# EAGLE design digit_mini (EAGLE 6.3)
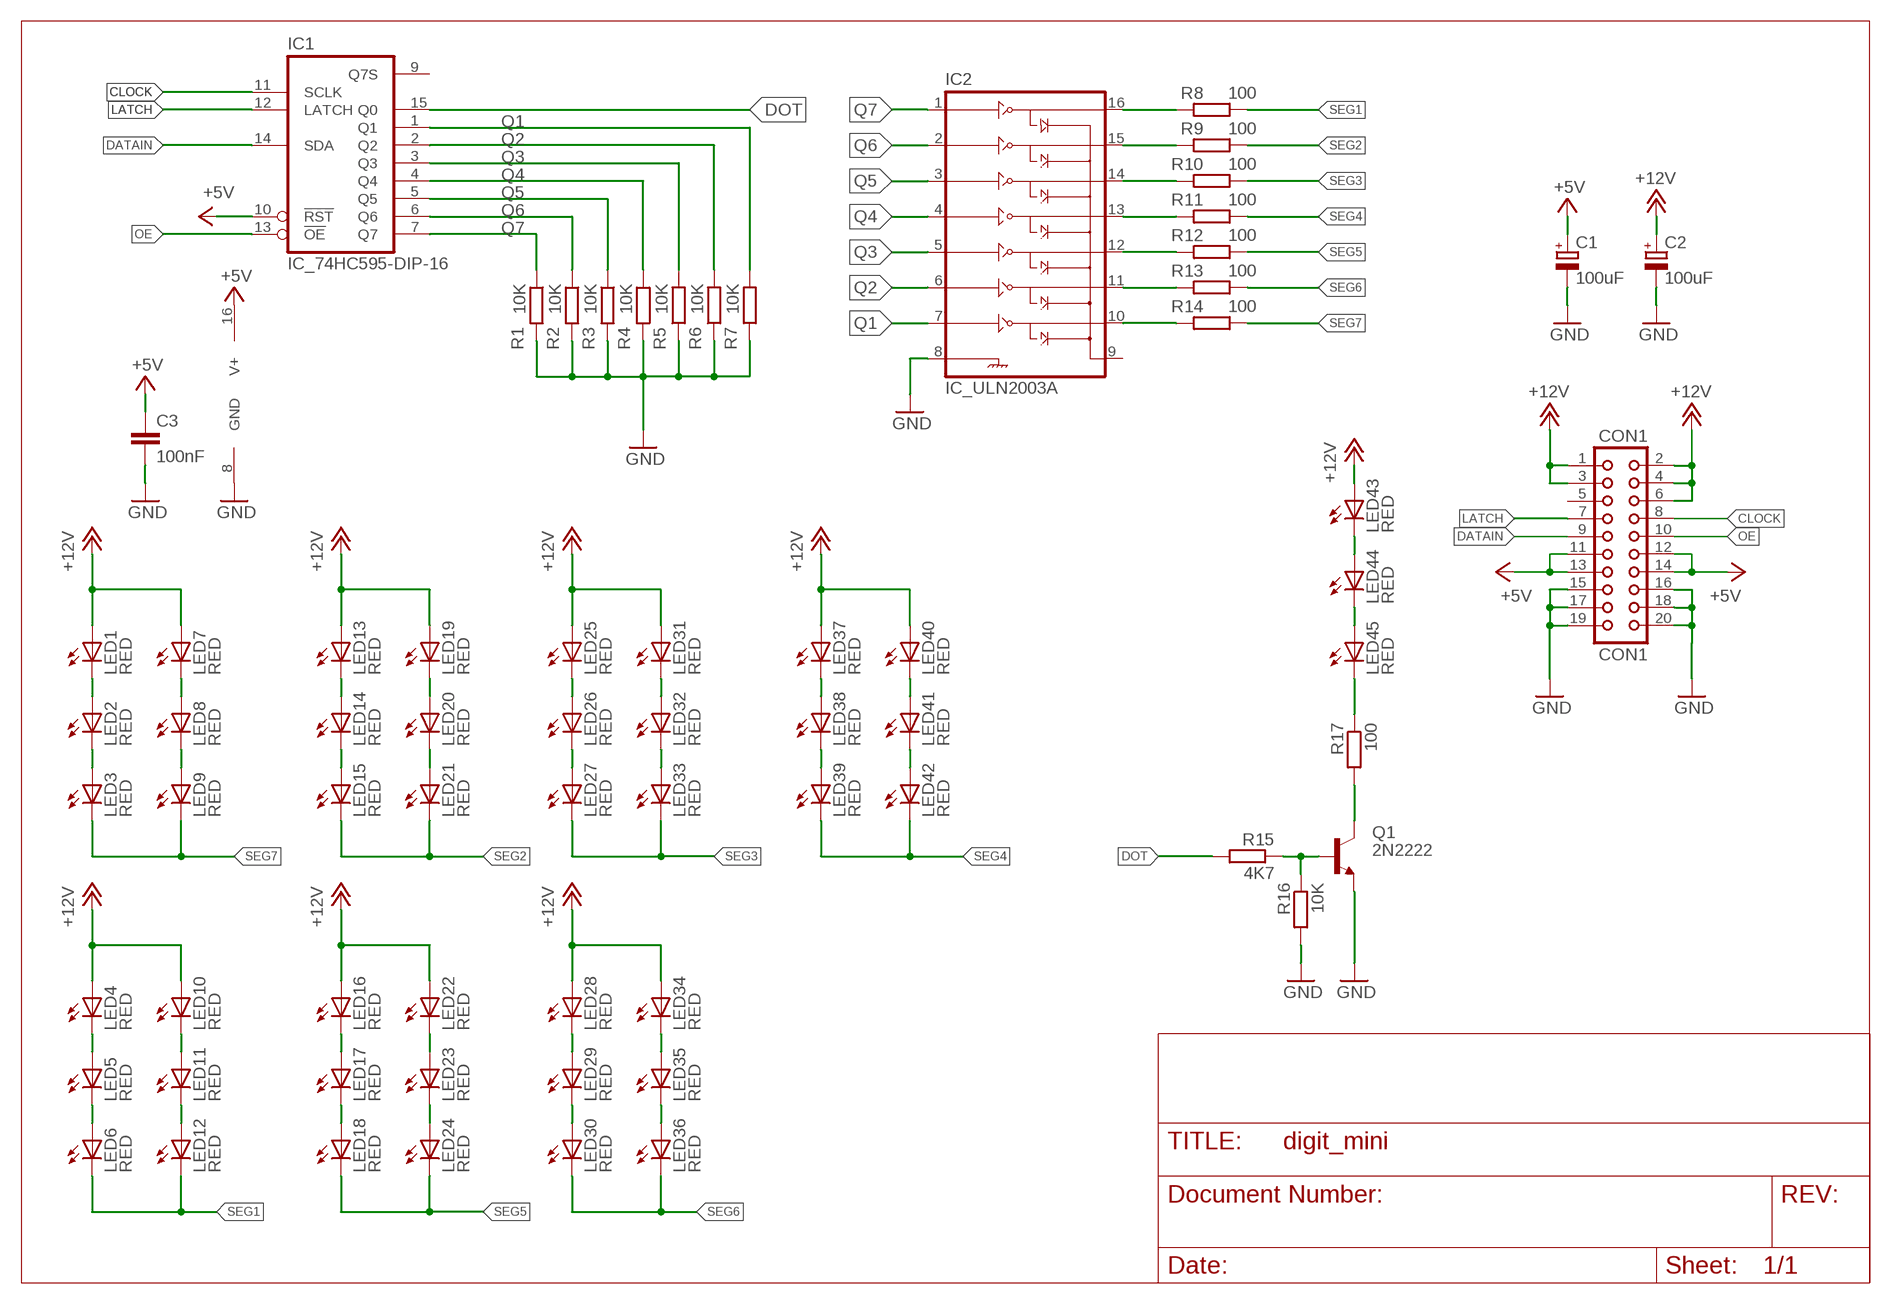
[diagram p0: schematic, sheet 1]

## Parts
C1  100uF  CPOL-EUE2.5-7  [E2,5-7]
C2  100uF  CPOL-EUE2.5-7  [E2,5-7]
C3  100nF  C-EU050-025X075  [C050-025X075]
CON1  CON1  CON20  [CON20]
IC1  IC_74HC595-DIP-16  [DIL16]
IC2  IC_ULN2003A  [DIL16]
LED1  RED  LED5MM  [LED5MM]
LED2  RED  LED5MM  [LED5MM]
LED3  RED  LED5MM  [LED5MM]
LED4  RED  LED5MM  [LED5MM]
LED5  RED  LED5MM  [LED5MM]
LED6  RED  LED5MM  [LED5MM]
LED7  RED  LED5MM  [LED5MM]
LED8  RED  LED5MM  [LED5MM]
LED9  RED  LED5MM  [LED5MM]
LED10  RED  LED5MM  [LED5MM]
LED11  RED  LED5MM  [LED5MM]
LED12  RED  LED5MM  [LED5MM]
LED13  RED  LED5MM  [LED5MM]
LED14  RED  LED5MM  [LED5MM]
LED15  RED  LED5MM  [LED5MM]
LED16  RED  LED5MM  [LED5MM]
LED17  RED  LED5MM  [LED5MM]
LED18  RED  LED5MM  [LED5MM]
LED19  RED  LED5MM  [LED5MM]
LED20  RED  LED5MM  [LED5MM]
LED21  RED  LED5MM  [LED5MM]
LED22  RED  LED5MM  [LED5MM]
LED23  RED  LED5MM  [LED5MM]
LED24  RED  LED5MM  [LED5MM]
LED25  RED  LED5MM  [LED5MM]
LED26  RED  LED5MM  [LED5MM]
LED27  RED  LED5MM  [LED5MM]
LED28  RED  LED5MM  [LED5MM]
LED29  RED  LED5MM  [LED5MM]
LED30  RED  LED5MM  [LED5MM]
LED31  RED  LED5MM  [LED5MM]
LED32  RED  LED5MM  [LED5MM]
LED33  RED  LED5MM  [LED5MM]
LED34  RED  LED5MM  [LED5MM]
LED35  RED  LED5MM  [LED5MM]
LED36  RED  LED5MM  [LED5MM]
LED37  RED  LED5MM  [LED5MM]
LED38  RED  LED5MM  [LED5MM]
LED39  RED  LED5MM  [LED5MM]
LED40  RED  LED5MM  [LED5MM]
LED41  RED  LED5MM  [LED5MM]
LED42  RED  LED5MM  [LED5MM]
LED43  RED  LED5MM  [LED5MM]
LED44  RED  LED5MM  [LED5MM]
LED45  RED  LED5MM  [LED5MM]
Q1  2N2222  -NPN-TO92-E1  [TO92-E1]
R1  10K  R-EU_0207/12  [0207/12]
R2  10K  R-EU_0207/12  [0207/12]
R3  10K  R-EU_0207/12  [0207/12]
R4  10K  R-EU_0207/12  [0207/12]
R5  10K  R-EU_0207/12  [0207/12]
R6  10K  R-EU_0207/12  [0207/12]
R7  10K  R-EU_0207/12  [0207/12]
R8  100  R-EU_0207/12  [0207/12]
R9  100  R-EU_0207/12  [0207/12]
R10  100  R-EU_0207/12  [0207/12]
R11  100  R-EU_0207/12  [0207/12]
R12  100  R-EU_0207/12  [0207/12]
R13  100  R-EU_0207/12  [0207/12]
R14  100  R-EU_0207/12  [0207/12]
R15  4K7  R-EU_0207/12  [0207/12]
R16  10K  R-EU_0207/12  [0207/12]
R17  100  R-EU_0207/12  [0207/12]

## Nets
+5V: C1.+ C3.1 CON1.11 CON1.12 CON1.13 CON1.14 IC1.10(!RST) IC1.16(V+)
+12V: C2.+ CON1.1 CON1.2 CON1.3 CON1.4 CON1.6 LED1.A LED4.A LED7.A LED10.A LED13.A LED16.A LED19.A LED22.A LED25.A LED28.A LED31.A LED34.A LED37.A LED40.A LED43.A
CLOCK: CON1.8 IC1.11(SCLK)
DATAIN: CON1.9 IC1.14(SDA)
DOT: IC1.15(Q0) R15.2
GND: C1.- C2.- C3.2 CON1.15 CON1.16 CON1.17 CON1.18 CON1.19 CON1.20 IC1.8(GND) IC2.8(GND) Q1.3(E) R1.2 R2.2 R3.2 R4.1 R5.1 R6.1 R7.1 R16.2
LATCH: CON1.7 IC1.12(LATCH)
N$1: LED45.K(C) R17.1
N$2: Q1.1(C) R17.2
N$8: IC2.15(2C) R9.2
N$9: LED13.K(C) LED14.A
N$10: LED14.K(C) LED15.A
N$11: IC2.14(3C) R10.2
N$12: IC2.13(4C) R11.2
N$13: LED19.K(C) LED20.A
N$14: LED20.K(C) LED21.A
N$16: IC2.12(5C) R12.2
N$17: IC2.11(6C) R13.2
N$19: IC2.10(7C) R14.2
N$20: LED25.K(C) LED26.A
N$21: IC2.16(1C) R8.2
N$22: LED26.K(C) LED27.A
N$23: LED1.K(C) LED2.A
N$24: LED2.K(C) LED3.A
N$25: LED7.K(C) LED8.A
N$26: LED8.K(C) LED9.A
N$28: LED31.K(C) LED32.A
N$29: LED32.K(C) LED33.A
N$31: LED37.K(C) LED38.A
N$32: LED38.K(C) LED39.A
N$33: LED40.K(C) LED41.A
N$34: LED41.K(C) LED42.A
N$36: LED16.K(C) LED17.A
N$37: LED17.K(C) LED18.A
N$38: LED22.K(C) LED23.A
N$39: LED23.K(C) LED24.A
N$41: LED28.K(C) LED29.A
N$42: LED29.K(C) LED30.A
N$43: LED34.K(C) LED35.A
N$44: LED35.K(C) LED36.A
N$46: LED4.K(C) LED5.A
N$47: LED5.K(C) LED6.A
N$48: LED10.K(C) LED11.A
N$49: LED11.K(C) LED12.A
N$50: LED43.K(C) LED44.A
N$51: Q1.2(B) R15.1 R16.1
N$52: LED44.K(C) LED45.A
OE: CON1.10 IC1.13(!OE)
Q1: IC1.1(Q1) IC2.7(7B) R7.2
Q2: IC1.2(Q2) IC2.6(6B) R6.2
Q3: IC1.3(Q3) IC2.5(5B) R5.2
Q4: IC1.4(Q4) IC2.4(4B) R4.2
Q5: IC1.5(Q5) IC2.3(3B) R3.1
Q6: IC1.6(Q6) IC2.2(2B) R2.1
Q7: IC1.7(Q7) IC2.1(1B) R1.1
SEG1: LED6.K(C) LED12.K(C) R8.1
SEG2: LED15.K(C) LED21.K(C) R9.1
SEG3: LED27.K(C) LED33.K(C) R10.1
SEG4: LED39.K(C) LED42.K(C) R11.1
SEG5: LED18.K(C) LED24.K(C) R12.1
SEG6: LED30.K(C) LED36.K(C) R13.1
SEG7: LED3.K(C) LED9.K(C) R14.1
Unconnected: CON1.5 IC1.9(Q7S) IC2.9(COM)

## Library data of the parts
C1 C2 = resistor:CPOL-EU: POLARIZED CAPACITOR, European symbol
C3 = rcl:C-EU: CAPACITOR, European symbol
CON1 = con-harting:CON20: CONNECTOR; OC_FARNELL: unknown; OC_NEWARK: unknown
IC1 = dp_devices:IC_74HC595: 8-bit serial-in parallel out shift register, output latch 3-state
IC2 = dp_devices:IC_ULN2003A: ULN2003A Seven Darlington array
LED1-LED45 = led:LED: LED OSRAM: - CHIPLED LG R971, LG N971, LY N971, LG Q971, LY Q971, LO R971, LY R971 LH N974, LH R974 LS Q976, LO Q976, LY Q976 LO Q996 - Hyper CHIPLED LW Q18S LB Q993, LB Q99A, LB R99A - SideLED LS A670, LO A670, LY A670, LG A670, LP A670 LB A673, LV A673, LT A673, LW A673 LH A674 LY A675 LS A676, LA A676, LO A676, LY A676, LW A676 LS A679, LY A679, LG A679 - Hyper Micro SIDELED® LS Y876, LA Y876, LO Y876, LY Y876 LT Y87S - SmartLED LW L88C, LW L88S LB L89C, LB L89S, LG L890 LS L89K, LO L89K, LY L89K LS L896, LA L896, LO L896, LY L896 - TOPLED LS T670, LO T670, LY T670, LG T670, LP T670 LSG T670, LSP T670, LSY T670, LOP T670, LYG T670 LG T671, LOG T671, LSG T671 LB T673, LV T673, LT T673, LW T673 LH T674 LS T676, LA T676, LO T676, LY T676, LB T676, LH T676, LSB T676, LW T676 LB T67C, LV T67C, LT T67C, LS T67K, LO T67K, LY T67K, LW E67C LS E67B, LA E67B, LO E67B, LY E67B, LB E67C, LV E67C, LT E67C LW T67C LS T679, LY T679, LG T679 LS T770, LO T770, LY T770, LG T770, LP T770 LB T773, LV T773, LT T773, LW T773 LH T774 LS E675, LA E675, LY E675, LS T675 LS T776, LA T776, LO T776, LY T776, LB T776 LHGB T686 LT T68C, LB T68C - Hyper Mini TOPLED® LB M676 - Mini TOPLED Santana® LG M470 LS M47K, LO M47K, LY M47K Source: http://www.osram.convergy.de LUXEON: - LUMILED® LXK2-PW12-R00, LXK2-PW12-S00, LXK2-PW14-U00, LXK2-PW14-V00 LXK2-PM12-R00, LXK2-PM12-S00, LXK2-PM14-U00 LXK2-PE12-Q00, LXK2-PE12-R00, LXK2-PE12-S00, LXK2-PE14-T00, LXK2-PE14-U00 LXK2-PB12-K00, LXK2-PB12-L00, LXK2-PB12-M00, LXK2-PB14-N00, LXK2-PB14-P00, LXK2-PB14-Q00 LXK2-PR12-L00, LXK2-PR12-M00, LXK2-PR14-Q00, LXK2-PR14-R00 LXK2-PD12-Q00, LXK2-PD12-R00, LXK2-PD12-S00 LXK2-PH12-R00, LXK2-PH12-S00 LXK2-PL12-P00, LXK2-PL12-Q00, LXK2-PL12-R00 Source: www.luxeon.com KINGBRIGHT: KA-3528ASYC Source: www.kingbright.com
Q1 = transistor:*-NPN-: NPN Transistror BF959 corrected 2008.03.06
R1-R17 = resistor:R-EU_: RESISTOR, European symbol

## Net classes
0 default: width 0.305 mm

## Board
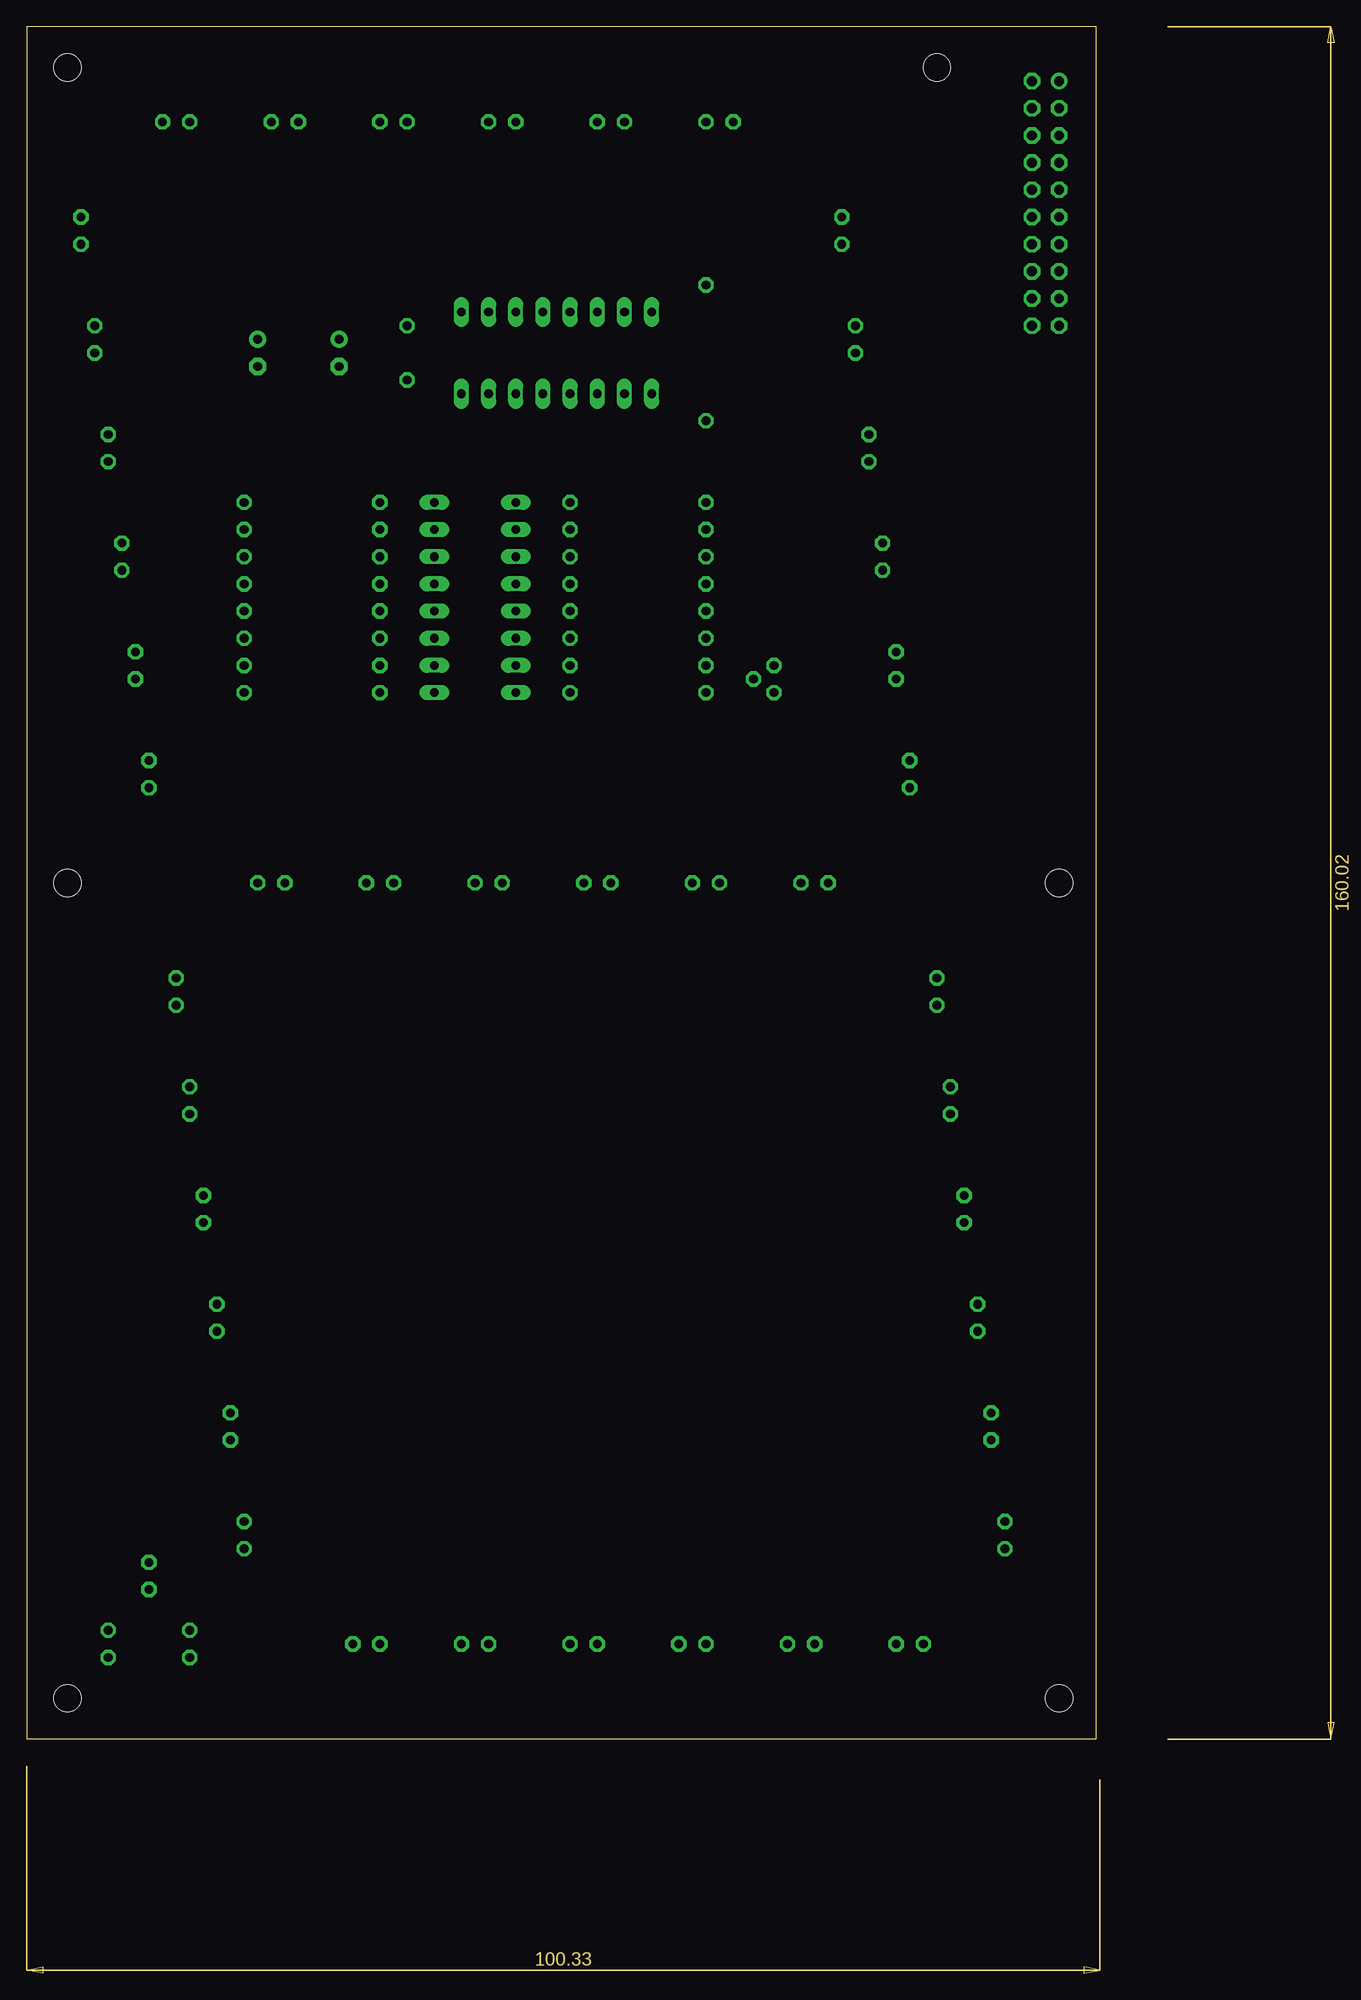
[diagram p1: board, top side]
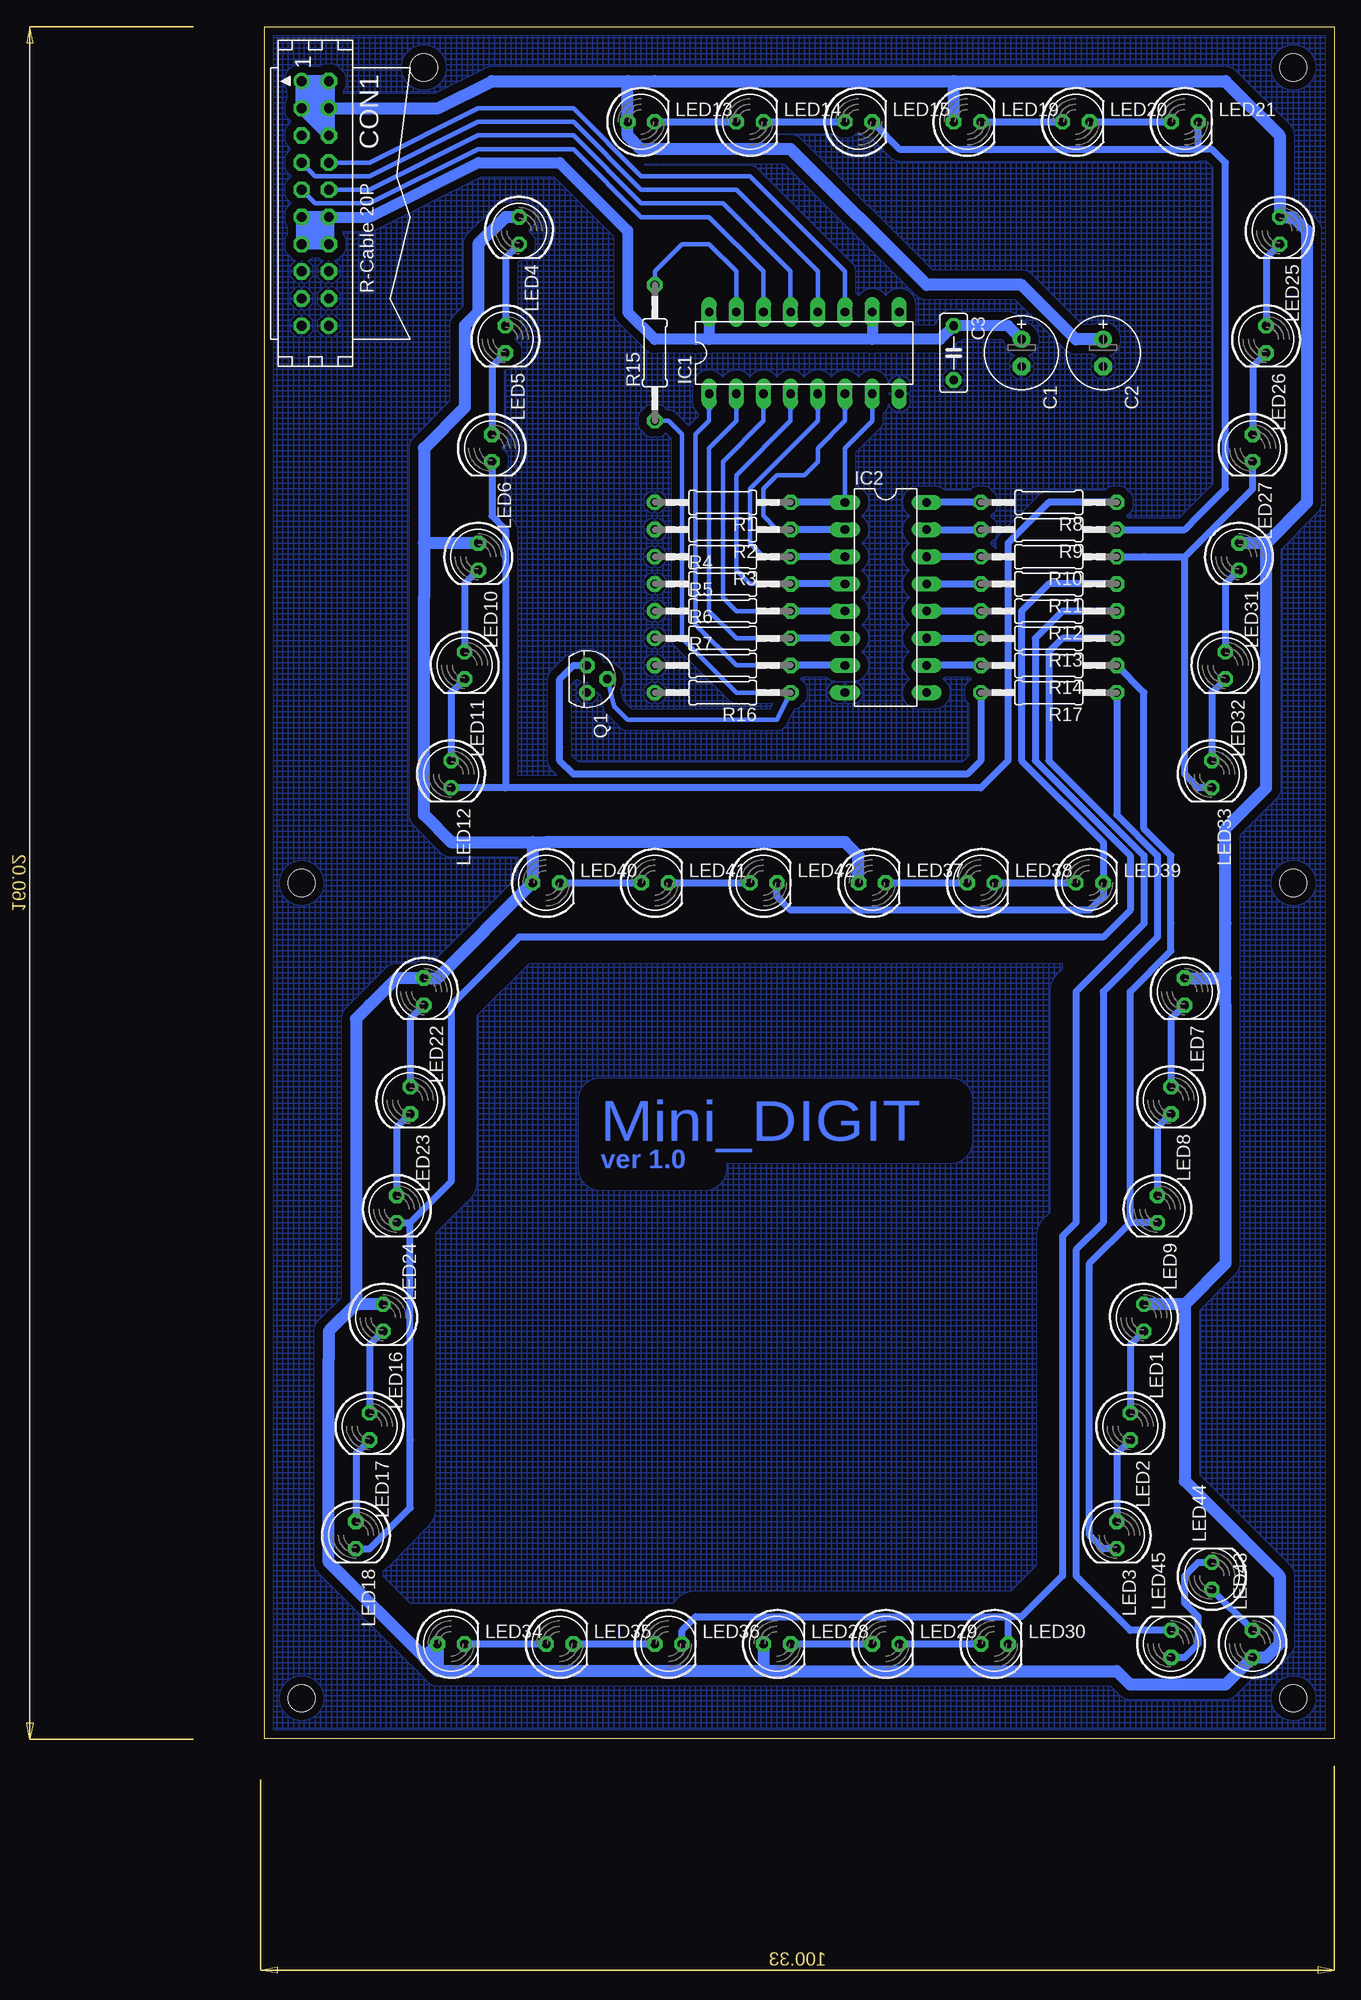
[diagram p2: board, bottom side, seen from below]

Size 100 x 160 mm. Coordinates in mm from the lower left corner, seen from the top.
Outline: 100,160 100,0 0,0 0,160
Outline: 100,160 0,160
Outline: 100,160 0,160
Copper layers (1*16): Top 0.035mm / dielectric 1.5mm / Bottom 0.035mm
Design rules "SparkFun": minimum track width 8mil, minimum drill 20mil, track to track 8mil, track to pad 8mil, pad to pad 8mil, via to via 8mil, smd to smd 8mil, copper to edge 10mil, drill to drill 8mil, minimum pad ring 12mil, minimum via ring 10mil, stop-mask expansion 4mil, vias tented up to drill 25mil, thermal gap 10mil
Holes 2.54 mm at 85.09,156.19 96.52,79.99 3.81,79.99 3.81,3.79 96.52,3.79 3.81,156.19

### Footprints (pad centres in the part's own frame; a part is rotated, then mirrored left to right if it is on the bottom)
E2,5-7 = drill 0.813 pad 1.6: + -1.27,0 | drill 0.813 pad 1.6 octagon: - 1.27,0
C050-025X075 = drill 0.813 octagon: 1 -2.54,0; 2 2.54,0
CON20 = drill 0.914: 1 -11.43,-1.27 | drill 0.914 octagon: 2 -11.43,1.27; 3 -8.89,-1.27; 4 -8.89,1.27; 5 -6.35,-1.27; 6 -6.35,1.27; 7 -3.81,-1.27; 8 -3.81,1.27; 9 -1.27,-1.27; 10 -1.27,1.27; 11 1.27,-1.27; 12 1.27,1.27; 13 3.81,-1.27; 14 3.81,1.27; 15 6.35,-1.27; 16 6.35,1.27; 17 8.89,-1.27; 18 8.89,1.27; 19 11.43,-1.27; 20 11.43,1.27
DIL16 = drill 0.813 long: 1 -8.89,-3.81; 2 -6.35,-3.81; 3 -3.81,-3.81; 4 -1.27,-3.81; 5 1.27,-3.81; 6 3.81,-3.81; 7 6.35,-3.81; 8 8.89,-3.81; 9 8.89,3.81; 10 6.35,3.81; 11 3.81,3.81; 12 1.27,3.81; 13 -1.27,3.81; 14 -3.81,3.81; 15 -6.35,3.81; 16 -8.89,3.81
LED5MM = drill 0.813 octagon: A -1.27,0; K 1.27,0
TO92-E1 = drill 0.813 octagon: 1 -1.27,0; 2 0,1.905; 3 1.27,0
0207/12 = drill 0.813 octagon: 1 -6.35,0; 2 6.35,0

### Placement (x,y rotation side)
C1  29.21,129.52 270 bottom
C2  21.59,129.52 270 bottom
C3  35.56,129.52 270 bottom
CON1  95.25,143.49 270 bottom
IC1  49.53,129.52 0 bottom
IC2  41.91,106.66 270 bottom
LED1  17.78,39.35 270 bottom
LED2  19.05,29.19 270 bottom
LED3  20.32,19.03 270 bottom
LED4  76.2,140.95 270 bottom
LED5  77.47,130.79 270 bottom
LED6  78.74,120.63 270 bottom
LED7  13.97,69.83 270 bottom
LED8  15.24,59.67 270 bottom
LED9  16.51,49.51 270 bottom
LED10  80.01,110.47 270 bottom
LED11  81.28,100.31 270 bottom
LED12  82.55,90.15 270 bottom
LED13  64.77,151.11 0 bottom
LED14  54.61,151.11 0 bottom
LED15  44.45,151.11 0 bottom
LED16  88.9,39.35 270 bottom
LED17  90.17,29.19 270 bottom
LED18  91.44,19.03 270 bottom
LED19  34.29,151.11 0 bottom
LED20  24.13,151.11 0 bottom
LED21  13.97,151.11 0 bottom
LED22  85.09,69.83 270 bottom
LED23  86.36,59.67 270 bottom
LED24  87.63,49.51 270 bottom
LED25  5.08,140.95 270 bottom
LED26  6.35,130.79 270 bottom
LED27  7.62,120.63 270 bottom
LED28  52.07,8.87 0 bottom
LED29  41.91,8.87 0 bottom
LED30  31.75,8.87 0 bottom
LED31  8.89,110.47 270 bottom
LED32  10.16,100.31 270 bottom
LED33  11.43,90.15 270 bottom
LED34  82.55,8.87 0 bottom
LED35  72.39,8.87 0 bottom
LED36  62.23,8.87 0 bottom
LED37  43.18,79.99 0 bottom
LED38  33.02,79.99 0 bottom
LED39  22.86,79.99 0 bottom
LED40  73.66,79.99 0 bottom
LED41  63.5,79.99 0 bottom
LED42  53.34,79.99 0 bottom
LED43  7.62,8.87 90 bottom
LED44  11.43,15.22 90 bottom
LED45  15.24,8.87 90 bottom
Q1  69.85,99.04 270 bottom
R1  57.15,115.55 180 bottom
R2  57.15,113.01 180 bottom
R3  57.15,110.47 180 bottom
R4  57.15,107.93 0 bottom
R5  57.15,105.39 0 bottom
R6  57.15,102.85 0 bottom
R7  57.15,100.31 0 bottom
R8  26.67,115.55 180 bottom
R9  26.67,113.01 180 bottom
R10  26.67,110.47 180 bottom
R11  26.67,107.93 180 bottom
R12  26.67,105.39 180 bottom
R13  26.67,102.85 180 bottom
R14  26.67,100.31 180 bottom
R15  63.5,129.52 90 bottom
R16  57.15,97.77 180 bottom
R17  26.67,97.77 180 bottom
U$1  [LOGO_DAM+]  15.24,138.41 0 top

### Tracks (layer width: path | path; a pad name or v marks a point on that pad's centre or on a via)
+5V
  Bottom 1.016: 58.42,130.79 IC1.16 58.42,130.79 | CON1.11 CON1.13 CON1.14 CON1.12 90.17,142.22 80.01,147.3 72.39,147.3 66.04,140.95 66.04,133.33 63.5,130.79 59.69,130.79 58.42,130.79 | IC1.10 43.18,130.79 | 43.18,130.79 58.42,130.79 | 43.18,130.79 36.83,130.79 C3.1 30.48,132.06 C1.+
  Bottom 1.143: CON1.14 CON1.11 CON1.12 CON1.13
+12V
  Bottom 0.635: CON1.6 93.98,151.11 CON1.4 CON1.2
  Bottom 1.143: 53.34,6.33 50.8,6.33 20.32,6.33 19.05,5.06 10.16,5.06 LED43.A 6.35,7.6 5.08,8.87 5.08,10.14 5.08,15.22 13.97,24.11 13.97,40.62 | 53.34,6.33 81.28,6.33 83.82,6.33 | 83.82,6.33 85.09,7.6 | 85.09,7.6 93.98,16.49 93.98,35.54 93.98,38.08 91.44,40.62 | 63.5,154.92 66.04,154.92 66.04,152.38 LED13.A 66.04,149.84 64.77,148.57 63.5,148.57 50.8,148.57 38.1,135.87 29.21,135.87 24.13,130.79 C2.+ | 63.5,154.92 35.56,154.92 | 35.56,154.92 10.16,154.92 5.08,149.84 LED25.A 3.81,142.22 2.54,140.95 2.54,115.55 6.35,111.74 | LED19.A 35.56,154.92 | 6.35,111.74 LED31.A | 74.93,83.8 LED40.A 83.82,71.1 LED22.A 87.63,71.1 90.17,68.56 91.44,67.29 91.44,40.62 | 13.97,40.62 10.16,44.43 10.16,68.56 10.16,71.1 | 13.97,40.62 LED1.A | CON1.3 CON1.4 | CON1.4 83.82,152.38 78.74,154.92 63.5,154.92 | CON1.3 CON1.1 | CON1.2 CON1.1 | 6.35,111.74 6.35,88.88 10.16,85.07 10.16,76.18 10.16,71.1 | LED7.A 10.16,71.1 | LED28.A 53.34,6.33 | 83.82,6.33 LED34.A 85.09,7.6 | LED16.A 91.44,40.62 | 85.09,111.74 85.09,120.63 81.28,124.44 81.28,132.06 80.01,133.33 80.01,134.6 80.01,139.68 77.47,142.22 LED4.A | 85.09,111.74 85.09,106.66 85.09,86.34 82.55,83.8 74.93,83.8 | LED10.A 85.09,111.74 | LED37.A 44.45,82.53 45.72,83.8 50.8,83.8 73.66,83.8 74.93,83.8 | CON1.2 CON1.4 | CON1.4 93.98,151.11 | 93.98,151.11 CON1.6 CON1.3 | CON1.4 CON1.1 | CON1.2 CON1.3 | CON1.3 95.25,152.38 93.98,151.11
CLOCK
  Bottom 0.406: CON1.8 90.17,147.3 80.01,152.38 71.12,152.38 64.77,146.03 54.61,146.03 48.26,139.68 45.72,137.14 IC1.11
DATAIN
  Bottom 0.406: IC1.14 53.34,137.14 58.42,142.22 64.77,142.22 71.12,148.57 80.01,148.57 90.17,143.49 95.25,143.49 CON1.9
DOT
  Bottom 0.406: IC1.15 55.88,137.14 58.42,139.68 60.96,139.68 63.5,137.14 R15.2
GND
  pour Bottom (isolate 0.762, hatched): -2.54,162.54 -2.54,-2.56 102.87,-2.56 102.87,162.54
LATCH
  Bottom 0.406: IC1.12 48.26,137.14 55.88,144.76 64.77,144.76 71.12,151.11 80.01,151.11 90.17,146.03 95.25,146.03 CON1.7
N$1
  Bottom 0.635: R17.1 20.32,86.34 16.51,82.53 16.51,74.91 21.59,69.83 21.59,48.24 24.13,45.7 24.13,15.22 19.05,10.14 LED45.K
N$2
  Bottom 0.635: R17.2 33.02,91.42 34.29,90.15 71.12,90.15 72.39,91.42 72.39,92.69 72.39,99.04 71.12,100.31 Q1.1
N$3
  pour Bottom (isolate 2.032, hatched): 25.4,73.64 25.4,49.51 26.67,48.24 26.67,16.49 30.48,12.68 86.36,12.68 88.9,15.22 88.9,16.49 85.09,20.3 85.09,46.97 81.28,50.78 81.28,67.29 74.93,73.64
N$8
  Bottom 0.635: IC2.15 R9.2
N$9
  Bottom 0.635: LED13.K LED14.A
N$10
  Bottom 0.635: LED14.K LED15.A
N$11
  Bottom 0.635: R10.2 IC2.14
N$12
  Bottom 0.635: IC2.13 R11.2
N$13
  Bottom 0.635: LED19.K LED20.A
N$14
  Bottom 0.635: LED20.K LED21.A
N$16
  Bottom 0.635: R12.2 IC2.12
N$17
  Bottom 0.635: IC2.11 R13.2
N$19
  Bottom 0.635: R14.2 IC2.10
N$20
  Bottom 0.635: LED26.A 6.35,138.41 LED25.K
N$21
  Bottom 0.635: R8.2 IC2.16
N$22
  Bottom 0.635: LED27.A 7.62,128.25 LED26.K
N$23
  Bottom 0.635: LED2.A 19.05,36.81 LED1.K
N$24
  Bottom 0.635: LED3.A 20.32,26.65 LED2.K
N$25
  Bottom 0.635: LED8.A 15.24,67.29 LED7.K
N$26
  Bottom 0.635: LED9.A 16.51,57.13 LED8.K
N$28
  Bottom 0.635: LED32.A 10.16,107.93 LED31.K
N$29
  Bottom 0.635: LED33.A 11.43,97.77 LED32.K
N$31
  Bottom 0.635: LED37.K LED38.A
N$32
  Bottom 0.635: LED38.K LED39.A
N$33
  Bottom 0.635: LED40.K LED41.A
N$34
  Bottom 0.635: LED41.K LED42.A
N$36
  Bottom 0.635: LED17.A 90.17,36.81 LED16.K
N$37
  Bottom 0.635: LED18.A 91.44,26.65 LED17.K
N$38
  Bottom 0.635: LED23.A 86.36,67.29 LED22.K
N$39
  Bottom 0.635: LED24.A 87.63,57.13 LED23.K
N$41
  Bottom 0.635: LED28.K LED29.A
N$42
  Bottom 0.635: LED29.K LED30.A
N$43
  Bottom 0.635: LED34.K LED35.A
N$44
  Bottom 0.635: LED35.K LED36.A
N$46
  Bottom 0.635: LED5.A 77.47,138.41 LED4.K
N$47
  Bottom 0.635: LED6.A 78.74,128.25 LED5.K
N$48
  Bottom 0.635: LED11.A 81.28,107.93 LED10.K
N$49
  Bottom 0.635: LED12.A 82.55,97.77 LED11.K
N$50
  Bottom 0.635: LED43.K LED44.A
N$51
  Bottom 0.406: Q1.2 67.31,96.5 66.04,95.23 52.07,95.23 R16.1 55.88,97.77 60.96,102.85 60.96,121.9 62.23,123.17 R15.1
N$52
  Bottom 0.635: LED45.A 13.97,7.6 12.7,8.87 12.7,10.14 12.7,11.41 13.97,12.68 13.97,15.22 12.7,16.49 LED44.K
OE
  Bottom 0.406: IC1.13 50.8,137.14 57.15,143.49 64.77,143.49 71.12,149.84 80.01,149.84 90.17,144.76 CON1.10
Q1
  Bottom 0.406: R7.2 55.88,100.31 59.69,104.12 59.69,121.9 58.42,123.17 58.42,124.44
  Bottom 0.635: IC2.7 R7.2 | IC1.1 58.42,124.44
Q2
  Bottom 0.406: R6.2 55.88,102.85 58.42,105.39 58.42,120.63 55.88,123.17 IC1.2
  Bottom 0.457: 55.88,124.44 IC1.2
  Bottom 0.635: IC2.6 R6.2
Q3
  Bottom 0.406: R5.2 55.88,105.39 57.15,106.66 57.15,119.36 53.34,123.17 IC1.3
  Bottom 0.457: 53.34,124.44 IC1.3
  Bottom 0.635: IC2.5 R5.2
Q4
  Bottom 0.406: R4.2 54.61,107.93 55.88,109.2 55.88,118.09 50.8,123.17 50.8,124.44
  Bottom 0.635: 50.8,124.44 IC1.4 | IC2.4 R4.2
Q5
  Bottom 0.406: R3.1 53.34,110.47 54.61,111.74 54.61,116.82 48.26,123.17 48.26,124.44
  Bottom 0.635: IC2.3 R3.1 | 48.26,124.44 IC1.5
Q6
  Bottom 0.406: 45.72,124.44 45.72,123.17 48.26,120.63 48.26,119.36 49.53,118.09 50.8,118.09 52.07,118.09 53.34,116.82 53.34,115.55 53.34,114.28 52.07,113.01 R2.1
  Bottom 0.635: IC2.2 R2.1 | IC1.6 45.72,124.44
Q7
  Bottom 0.406: IC1.7 43.18,123.17 45.72,120.63 IC2.1
  Bottom 0.635: IC2.1 R1.1
SEG1
  Bottom 0.635: R8.1 26.67,115.55 30.48,111.74 30.48,91.42 33.02,88.88 77.47,88.88 | 77.47,88.88 LED12.K | LED6.K 78.74,114.28 77.47,113.01 77.47,88.88
SEG2
  Bottom 0.635: R9.1 13.97,113.01 12.7,114.28 10.16,116.82 10.16,147.3 11.43,148.57 12.7,148.57 | 12.7,148.57 LED21.K | LED15.K 40.64,148.57 12.7,148.57
SEG3
  Bottom 0.635: R10.1 17.78,110.47 13.97,110.47 | 13.97,110.47 7.62,116.82 LED27.K | LED33.K 12.7,88.88 13.97,90.15 13.97,110.47
SEG4
  Bottom 0.406: 21.59,83.8 LED39.K
  Bottom 0.635: R11.1 26.67,107.93 29.21,105.39 29.21,91.42 21.59,83.8 21.59,78.72 22.86,77.45 50.8,77.45 52.07,78.72 LED42.K
SEG5
  Bottom 0.406: 86.36,48.24 LED24.K
  Bottom 0.635: R12.1 25.4,105.39 27.94,102.85 27.94,91.42 19.05,82.53 19.05,77.45 21.59,74.91 76.2,74.91 82.55,68.56 82.55,52.05 86.36,48.24 | LED18.K 90.17,17.76 86.36,21.57 86.36,27.92 86.36,41.89 86.36,48.24 | LED24.K 86.36,48.24
SEG6
  Bottom 0.635: R13.1 25.4,102.85 26.67,101.58 26.67,91.42 17.78,82.53 17.78,76.18 24.13,69.83 24.13,48.24 25.4,46.97 25.4,15.22 29.21,11.41 30.48,11.41 | 30.48,11.41 LED30.K | LED36.K 60.96,10.14 59.69,11.41 30.48,11.41
SEG7
  Bottom 0.635: LED3.K 21.59,17.76 22.86,19.03 22.86,44.43 19.05,48.24 | 19.05,48.24 19.05,63.48 19.05,68.56 19.05,69.83 15.24,73.64 15.24,76.18 15.24,82.53 17.78,85.07 17.78,97.77 R14.1 | LED9.K 19.05,48.24

### Text on the board
Bottom: Mini_DIGIT | ver 1.0
ResistanceBottom: 5.7mo 8.8 A | 6.3mo 8.8 A | 3.4mo 8.8 A | 1.3mo 8.8 A | 5.6mo 4.4 A | 2.8mo 8.8 A | 1.0mo 5.9 A | 3.1mo 5.9 A | 3.1mo 5.9 A | 3.1mo 5.9 A | 3.1mo 5.9 A | 5.6mo 4.4 A | 1.6mo 8.8 A | 5.6mo 4.4 A | 7.2mo 4.4 A | 1.0mo 5.9 A | 1.0mo 5.9 A | 11.3mo 5.9 A | 1.5mo 5.9 A | 2.8mo 8.8 A | 5.7mo 4.4 A | 5.6mo 4.4 A | 7.2mo 4.4 A | 5.7mo 4.4 A | 1.9mo 8.2 A | 7.2mo 4.4 A | 2.4mo 4.4 A | 6.4mo 4.4 A | 5.7mo 4.4 A | 7.2mo 4.4 A | 3.2mo 4.4 A | 1.1mo 4.4 A | 5.6mo 4.4 A | 2.4mo 4.4 A | 5.7mo 4.4 A | 2.9mo 8.2 A | 1.7mo 8.8 A | 4.8mo 4.4 A | 3.2mo 4.4 A | 1.1mo 4.4 A | 5.7mo 4.4 A | 4.0mo 4.4 A | 2.3mo 8.2 A | 6.8mo 4.4 A | 1.6mo 4.4 A | 4.0mo 8.8 A | 5.7mo 4.4 A | 4.5mo 4.4 A | 2.3mo 4.4 A | 2.3mo 4.4 A | 2.3mo 4.4 A | 2.0mo 8.8 A | 2.4mo 4.4 A | 2.4mo 4.4 A | 2.4mo 4.4 A | 2.4mo 4.4 A | 2.4mo 4.4 A | 1.9mo 8.2 A | 1.1mo 8.8 A | 2.6mo 5.9 A | 2.6mo 5.9 A | 1.3mo 8.2 A | 1.6mo 8.8 A | 12.3mo 5.9 A | 1.6mo 8.2 A | 3.8mo 8.2 A | 5.7mo 8.8 A | 1.2mo 8.8 A | 1.7mo 8.8 A | 2.6mo 5.9 A | 1.6mo 4.4 A | 2.3mo 4.4 A | 2.3mo 4.4 A | 1.6mo 4.4 A | 1.6mo 4.4 A | 2.3mo 4.4 A | 1.1mo 4.4 A | 2.6mo 5.9 A | 3.4mo 4.4 A | 1.1mo 4.4 A | 5.7mo 4.4 A | 4.5mo 4.4 A | 1.1mo 4.4 A | 1.1mo 4.4 A | 1.5mo 5.9 A | 3.2mo 4.4 A | 1.2mo 8.8 A | 1.0mo 5.9 A | 3.6mo 5.9 A | 2.6mo 5.9 A | 2.2mo 5.9 A | 2.1mo 5.9 A | 2.1mo 5.9 A | 2.1mo 5.9 A | 2.6mo 5.9 A | 2.1mo 5.9 A | 2.1mo 5.9 A | 1.1mo 4.4 A | 3.2mo 4.4 A | 2.0mo 8.8 A | 5.6mo 4.4 A | 8.0mo 4.4 A | 9.6mo 4.4 A | 11.2mo 4.4 A | 12.0mo 4.4 A | 1.1mo 8.8 A | 1.5mo 5.9 A | 1.0mo 5.9 A | 2.1mo 5.9 A | 2.1mo 5.9 A | 1.6mo 4.4 A | 1.1mo 4.4 A | 2.6mo 5.9 A | 1.5mo 5.9 A | 2.1mo 5.9 A | 2.1mo 5.9 A | 2.4mo 4.4 A | 1.1mo 4.4 A | 1.1mo 8.8 A | 2.1mo 5.9 A | 1.5mo 5.9 A | 2.1mo 5.9 A | 2.1mo 5.9 A | 3.2mo 4.4 A | 1.1mo 4.4 A | 2.6mo 5.9 A | 2.1mo 5.9 A | 2.1mo 5.9 A | 2.1mo 5.9 A | 3.2mo 4.4 A | 2.3mo 4.4 A | 2.6mo 5.9 A | 3.4mo 4.4 A | 8.2mo 5.9 A | 2.1mo 5.9 A | 2.1mo 5.9 A | 3.2mo 4.4 A | 4.5mo 4.4 A | 9.7mo 5.9 A | 8.2mo 5.9 A | 1.5mo 5.9 A | 1.8mo 4.4 A | 3.2mo 4.4 A | 5.1mo 8.8 A | 1.7mo 4.4 A | 5.6mo 5.9 A | 4.1mo 5.9 A | 4.6mo 5.9 A | 8.8mo 4.4 A | 1.1mo 4.4 A | 2.6mo 5.9 A | 2.6mo 5.9 A | 2.6mo 5.9 A | 2.6mo 5.9 A | 4.6mo 8.8 A | 1.5mo 5.9 A | 4.6mo 5.9 A | 14.9mo 5.9 A | 1.2mo 8.8 A | 5.1mo 5.9 A | 17.9mo 5.9 A | 2.1mo 5.9 A | 4.4mo 5.9 A | 5.1mo 5.9 A | 5.1mo 5.9 A | 2.2mo 5.9 A | 1.1mo 8.8 A | 5.1mo 8.8 A | 1.7mo 8.8 A | 1.5mo 5.9 A | 2.4mo 4.4 A | 3.1mo 5.9 A | 3.1mo 5.9 A | 3.1mo 5.9 A | 3.1mo 5.9 A | 2.1mo 5.9 A | 2.1mo 5.9 A | 2.8mo 8.8 A | 2.0mo 8.8 A | 2.6mo 5.9 A | 3.1mo 5.9 A | 2.6mo 5.9 A | 1.5mo 5.9 A | 11.3mo 5.9 A | 22.0mo 5.9 A | 2.9mo 5.9 A | 3.6mo 5.9 A | 3.6mo 5.9 A | 1.1mo 8.8 A | 2.1mo 5.9 A | 2.6mo 5.9 A | 2.6mo 5.9 A | 6.7mo 5.9 A | 8.7mo 5.9 A | 8.7mo 5.9 A | 6.2mo 5.9 A | 5.4mo 8.8 A | 2.6mo 5.9 A | 2.6mo 5.9 A | 2.2mo 5.9 A | 6.0mo 8.8 A | 1.0mo 5.9 A | 2.2mo 5.9 A | 1.5mo 5.9 A | 1.2mo 8.8 A | 2.6mo 5.9 A | 5.6mo 5.9 A | 2.6mo 5.9 A | 2.6mo 5.9 A | 10.3mo 5.9 A | 3.7mo 8.8 A | 12.8mo 5.9 A | 12.3mo 5.9 A | 2.6mo 5.9 A | 2.6mo 5.9 A | 2.6mo 5.9 A | 4.3mo 8.8 A | 2.2mo 5.9 A | 2.8mo 8.8 A | 2.2mo 5.9 A | 1.0mo 5.9 A | 2.2mo 5.9 A | 2.9mo 5.9 A | 11.8mo 5.9 A | 1.5mo 5.9 A | 1.1mo 8.8 A | 3.1mo 5.9 A | 3.1mo 5.9 A | 3.1mo 5.9 A | 3.1mo 5.9 A | 2.8mo 8.8 A | 1.0mo 5.9 A | 6.8mo 8.8 A | 6.3mo 8.8 A | 2.0mo 8.8 A